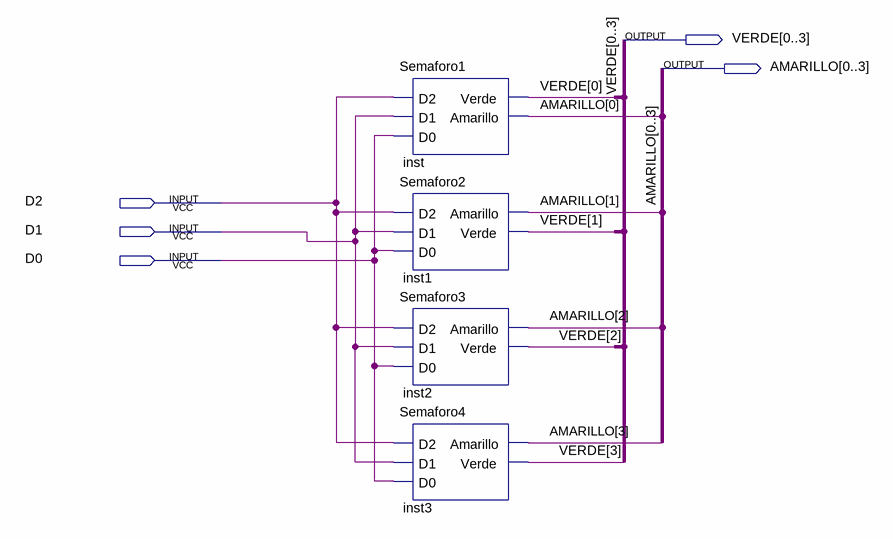
[diagram p0: schematic sheet]
// Quartus schematic DecodificadorSemaforo.bdf as structural Verilog: 4 symbols, 5 pins
module DecodificadorSemaforo (
  input  D2,
  input  D1,
  input  D0,
  output [0:3] VERDE,
  output [0:3] AMARILLO
);

  Semaforo1 inst (.D2(D2), .D1(D1), .D0(D0), .Verde(VERDE[0]), .Amarillo(AMARILLO[0]));
  Semaforo2 inst1 (.D2(D2), .D1(D1), .D0(D0), .Amarillo(AMARILLO[1]), .Verde(VERDE[1]));
  Semaforo3 inst2 (.D2(D2), .D1(D1), .D0(D0), .Amarillo(AMARILLO[2]), .Verde(VERDE[2]));
  Semaforo4 inst3 (.D2(D2), .D1(D1), .D0(D0), .Amarillo(AMARILLO[3]), .Verde(VERDE[3]));
endmodule
